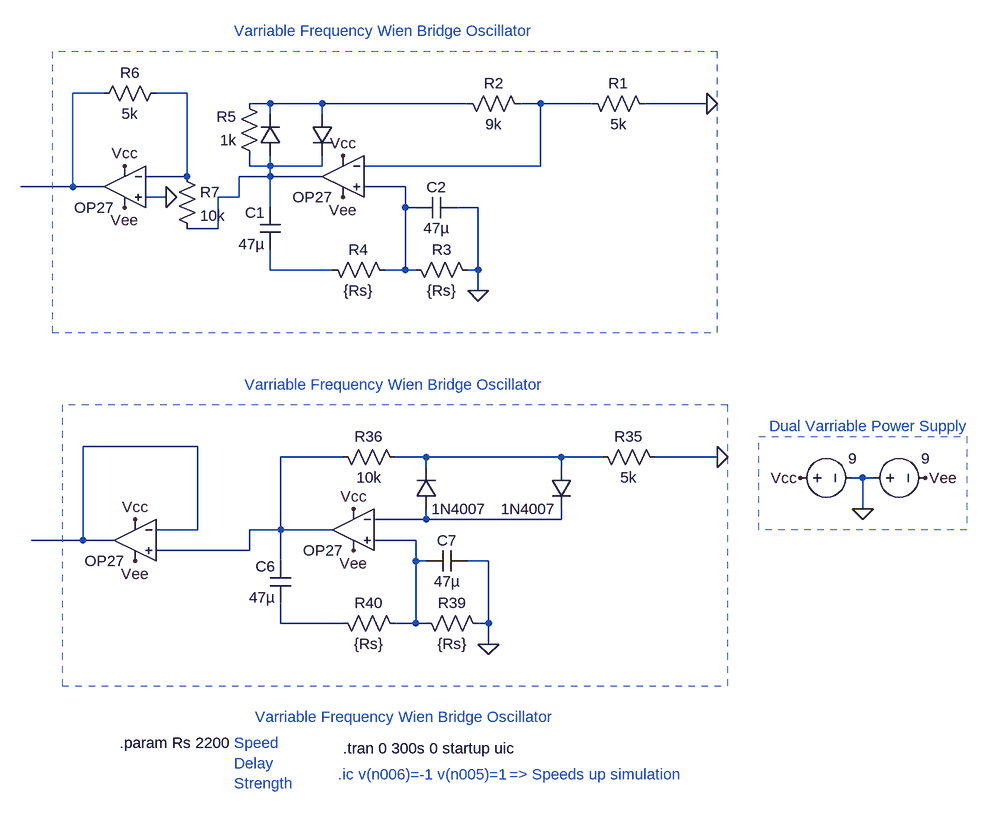
[diagram p0: schematic Reality.asc]
Reality.asc, the LTspice schematic file:
Version 4
SHEET 1 880 1988
WIRE -3856 -592 -3904 -592
WIRE -3728 -592 -3776 -592
WIRE -3600 -576 -3632 -576
WIRE -3520 -576 -3600 -576
WIRE -3296 -576 -3520 -576
WIRE -3184 -576 -3216 -576
WIRE -3104 -576 -3184 -576
WIRE -2928 -576 -3024 -576
WIRE -3600 -560 -3600 -576
WIRE -3520 -560 -3520 -576
WIRE -3632 -480 -3632 -496
WIRE -3600 -480 -3600 -496
WIRE -3600 -480 -3632 -480
WIRE -3520 -480 -3520 -496
WIRE -3520 -480 -3600 -480
WIRE -3184 -480 -3184 -576
WIRE -3184 -480 -3456 -480
WIRE -3728 -464 -3728 -592
WIRE -3728 -464 -3792 -464
WIRE -3600 -464 -3600 -480
WIRE -3600 -464 -3648 -464
WIRE -3520 -464 -3600 -464
WIRE -3904 -448 -3904 -592
WIRE -3904 -448 -3984 -448
WIRE -3856 -448 -3904 -448
WIRE -3392 -448 -3456 -448
WIRE -3760 -432 -3792 -432
WIRE -3648 -432 -3648 -464
WIRE -3648 -432 -3680 -432
WIRE -3600 -416 -3600 -464
WIRE -3392 -416 -3392 -448
WIRE -3376 -416 -3392 -416
WIRE -3280 -416 -3312 -416
WIRE -3680 -384 -3680 -432
WIRE -3680 -384 -3728 -384
WIRE -3600 -320 -3600 -352
WIRE -3504 -320 -3600 -320
WIRE -3392 -320 -3392 -416
WIRE -3392 -320 -3424 -320
WIRE -3376 -320 -3392 -320
WIRE -3280 -320 -3280 -416
WIRE -3280 -320 -3296 -320
WIRE -3280 -288 -3280 -320
WIRE -3712 -48 -3888 -48
WIRE -3488 -32 -3584 -32
WIRE -3360 -32 -3408 -32
WIRE -3152 -32 -3360 -32
WIRE -3088 -32 -3152 -32
WIRE -2912 -32 -3008 -32
WIRE -3360 -16 -3360 -32
WIRE -3152 -16 -3152 -32
WIRE -2688 0 -2704 0
WIRE -2672 0 -2688 0
WIRE -2688 48 -2688 0
WIRE -3360 64 -3360 48
WIRE -3360 64 -3440 64
WIRE -3152 64 -3152 48
WIRE -3152 64 -3360 64
WIRE -3712 80 -3712 -48
WIRE -3712 80 -3776 80
WIRE -3584 80 -3584 -32
WIRE -3584 80 -3632 80
WIRE -3504 80 -3584 80
WIRE -3888 96 -3888 -48
WIRE -3888 96 -3968 96
WIRE -3840 96 -3888 96
WIRE -3376 96 -3440 96
WIRE -3632 112 -3632 80
WIRE -3632 112 -3776 112
WIRE -3584 128 -3584 80
WIRE -3376 128 -3376 96
WIRE -3360 128 -3376 128
WIRE -3264 128 -3296 128
WIRE -3584 224 -3584 192
WIRE -3488 224 -3584 224
WIRE -3376 224 -3376 128
WIRE -3376 224 -3408 224
WIRE -3360 224 -3376 224
WIRE -3264 224 -3264 128
WIRE -3264 224 -3280 224
WIRE -3264 256 -3264 224
FLAG -2784 0 Vcc
FLAG -2688 48 0
FLAG -2592 0 Vee
FLAG -3472 112 Vee
FLAG -3472 48 Vcc
FLAG -2912 -32 0
FLAG -3264 256 0
FLAG -3808 64 Vcc
FLAG -3808 128 Vee
FLAG -3488 -432 Vee
FLAG -3488 -496 Vcc
FLAG -2928 -576 0
FLAG -3280 -288 0
FLAG -3824 -480 Vcc
FLAG -3824 -416 Vee
FLAG -3760 -432 0
SYMBOL voltage -2800 0 R270
WINDOW 0 24 16 Invisible 2
WINDOW 3 30 90 VRight 2
WINDOW 123 0 0 Left 2
WINDOW 39 0 0 Left 2
SYMATTR InstName V1
SYMATTR Value 9
SYMBOL voltage -2688 0 R270
WINDOW 0 24 16 Invisible 2
WINDOW 3 30 90 VRight 2
WINDOW 123 0 0 Left 2
WINDOW 39 0 0 Left 2
SYMATTR InstName V2
SYMATTR Value 9
SYMBOL Opamps\\OP27 -3472 16 M0
WINDOW 0 16 32 Invisible 2
SYMATTR InstName U14
SYMBOL res -2992 -16 M270
WINDOW 0 32 56 VTop 2
WINDOW 3 0 56 VBottom 2
SYMATTR InstName R35
SYMATTR Value 5k
SYMBOL res -3392 -16 M270
WINDOW 0 32 56 VTop 2
WINDOW 3 0 56 VBottom 2
SYMATTR InstName R36
SYMATTR Value 10k
SYMBOL cap -3568 128 M0
SYMATTR InstName C6
SYMATTR Value 47µ
SYMBOL cap -3360 112 M90
WINDOW 0 0 32 VBottom 2
WINDOW 3 32 32 VTop 2
SYMATTR InstName C7
SYMATTR Value 47µ
SYMBOL diode -3136 -16 M0
WINDOW 0 24 0 Invisible 2
SYMATTR InstName D9
SYMATTR Value 1N4007
SYMBOL diode -3376 48 M180
WINDOW 0 24 64 Invisible 2
WINDOW 3 24 0 Left 2
SYMATTR InstName D10
SYMATTR Value 1N4007
SYMBOL Opamps\\OP27 -3808 32 M0
WINDOW 0 16 32 Invisible 2
SYMATTR InstName U15
SYMBOL res -3376 208 M90
WINDOW 0 0 56 VBottom 2
WINDOW 3 32 56 VTop 2
SYMATTR InstName R39
SYMATTR Value {Rs}
SYMBOL res -3504 208 M90
WINDOW 0 0 56 VBottom 2
WINDOW 3 32 56 VTop 2
SYMATTR InstName R40
SYMATTR Value {Rs}
SYMBOL Opamps\\OP27 -3488 -528 M0
WINDOW 0 16 32 Invisible 2
SYMATTR InstName U1
SYMBOL res -3008 -560 M270
WINDOW 0 32 56 VTop 2
WINDOW 3 0 56 VBottom 2
SYMATTR InstName R1
SYMATTR Value 5k
SYMBOL res -3200 -560 M270
WINDOW 0 32 56 VTop 2
WINDOW 3 0 56 VBottom 2
SYMATTR InstName R2
SYMATTR Value 9k
SYMBOL cap -3584 -416 M0
SYMATTR InstName C1
SYMATTR Value 47µ
SYMBOL cap -3376 -432 M90
WINDOW 0 0 32 VBottom 2
WINDOW 3 32 32 VTop 2
SYMATTR InstName C2
SYMATTR Value 47µ
SYMBOL diode -3504 -560 M0
WINDOW 0 24 0 Invisible 2
WINDOW 3 24 64 Invisible 2
SYMATTR InstName D1
SYMATTR Value 1N4007
SYMBOL diode -3616 -496 M180
WINDOW 0 24 64 Invisible 2
WINDOW 3 24 0 Invisible 2
SYMATTR InstName D2
SYMATTR Value 1N4007
SYMBOL Opamps\\OP27 -3824 -512 M0
WINDOW 0 16 32 Invisible 2
SYMATTR InstName U2
SYMBOL res -3392 -336 M90
WINDOW 0 0 56 VBottom 2
WINDOW 3 32 56 VTop 2
SYMATTR InstName R3
SYMATTR Value {Rs}
SYMBOL res -3520 -336 M90
WINDOW 0 0 56 VBottom 2
WINDOW 3 32 56 VTop 2
SYMATTR InstName R4
SYMATTR Value {Rs}
SYMBOL res -3616 -480 R180
WINDOW 0 36 76 Left 2
WINDOW 3 36 40 Left 2
SYMATTR InstName R5
SYMATTR Value 1k
SYMBOL res -3760 -608 R90
WINDOW 0 0 56 VBottom 2
WINDOW 3 32 56 VTop 2
SYMATTR InstName R6
SYMATTR Value 5k
SYMBOL res -3744 -480 R0
SYMATTR InstName R7
SYMATTR Value 10k
TEXT -3488 416 Left 2 !.tran 0 300s 0 startup uic
TEXT -3160 368 Right 2 ;Varriable Frequency Wien Bridge Oscillator
TEXT -3832 408 Left 2 !.param Rs 2200
TEXT -3656 408 Left 2 ;Speed\nDelay\nStrength
TEXT -3496 456 Left 2 ;.ic v(n006)=-1 v(n005)=1
TEXT -2832 -80 Left 2 ;Dual Varriable Power Supply
TEXT -3232 456 Left 2 ;=> Speeds up simulation
TEXT -3176 -144 Right 2 ;Varriable Frequency Wien Bridge Oscillator
TEXT -3192 -688 Right 2 ;Varriable Frequency Wien Bridge Oscillator
RECTANGLE Normal -2528 80 -2848 -64 2
RECTANGLE Normal -3920 320 -2896 -112 2
RECTANGLE Normal -3936 -224 -2912 -656 2

The netlist it stands for:
* Reality.asc
V1 Vcc 0 9
V2 0 Vee 9
XU14 N012 N011 Vcc Vee N009 OP27  ; pins In+ In- V+ V- OUT
R35 0 N010 5k
R36 N010 N009 10k
C6 N009 N013 47µ
C7 N012 0 47µ
D9 N010 N011 1N4007
D10 N011 N010 1N4007
XU15 N009 N008 Vcc Vee N008 OP27  ; pins In+ In- V+ V- OUT
R39 N012 0 {Rs}
R40 N013 N012 {Rs}
XU1 N006 N004 Vcc Vee N005 OP27  ; pins In+ In- V+ V- OUT
R1 0 N004 5k
R2 N004 N003 9k
C1 N005 N007 47µ
C2 N006 0 47µ
D1 N003 N005 1N4007
D2 N005 N003 1N4007
XU2 0 N002 Vcc Vee N001 OP27  ; pins In+ In- V+ V- OUT
R3 N006 0 {Rs}
R4 N007 N006 {Rs}
R5 N005 N003 1k
R6 N002 N001 5k
R7 N002 N005 10k
.model D D
.lib standard.dio
.tran 0 300s 0 startup uic
* Varriable Frequency Wien Bridge Oscillator
.param Rs 2200
* Speed
* Delay
* Strength
* .ic v(n006)=-1 v(n005)=1
* Dual Varriable Power Supply
* => Speeds up simulation
* Varriable Frequency Wien Bridge Oscillator
* Varriable Frequency Wien Bridge Oscillator
.lib ADI.lib
.backanno
.end